# EAGLE design Strain_Gauges_Amplifier_TH (EAGLE 7.6.0)
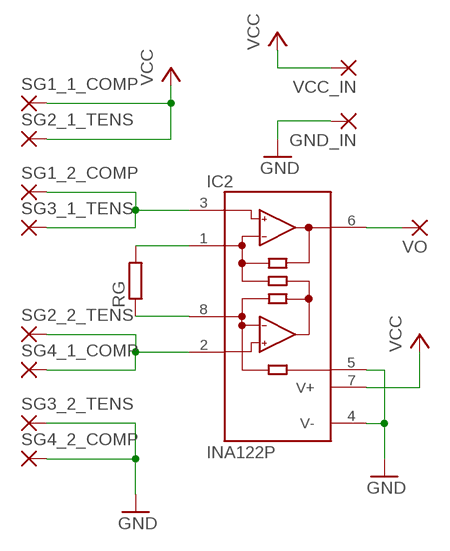
[diagram p0: schematic, sheet 1]

## Parts
GND_IN  SMD2  [SMD1,27-2,54]
IC2  INA122P  [DIL08]
RG  R-EU_0204/7  [0204/7]
SG1_1_COMP  SMD2  [SMD1,27-2,54]
SG1_2_COMP  SMD2  [SMD1,27-2,54]
SG2_1_TENS  SMD2  [SMD1,27-2,54]
SG2_2_TENS  SMD2  [SMD1,27-2,54]
SG3_1_TENS  SMD2  [SMD1,27-2,54]
SG3_2_TENS  SMD2  [SMD1,27-2,54]
SG4_1_COMP  SMD2  [SMD1,27-2,54]
SG4_2_COMP  SMD2  [SMD1,27-2,54]
VCC_IN  SMD2  [SMD1,27-2,54]
VO  SMD2  [SMD1,27-2,54]

## Nets
GND: GND_IN.1(P) IC2.4(V-) IC2.5(REF) SG3_2_TENS.1(P) SG4_2_COMP.1(P)
N$1: IC2.1(RG) RG.2
N$2: IC2.8(RG) RG.1
N$3: IC2.3(+IN) SG1_2_COMP.1(P) SG3_1_TENS.1(P)
N$5: IC2.2(-IN) SG2_2_TENS.1(P) SG4_1_COMP.1(P)
VCC: IC2.7(V+) SG1_1_COMP.1(P) SG2_1_TENS.1(P) VCC_IN.1(P)
VO: IC2.6(OUT) VO.1(P)

## Library data of the parts
GND_IN SG1_1_COMP SG1_2_COMP SG2_1_TENS SG2_2_TENS SG3_1_TENS SG3_2_TENS SG4_1_COMP SG4_2_COMP VCC_IN VO = wirepad:SMD2: SMD PAD
IC2 = burr-brown:INA122: Instrumentation Amplifier Single Supply, MicroPower; MF: TEXAS INSTRUMENTS; MPN: INA122P; OC_FARNELL: 1459460; OC_NEWARK: 15M0948
RG = rcl:R-EU_: RESISTOR, European symbol

## Board
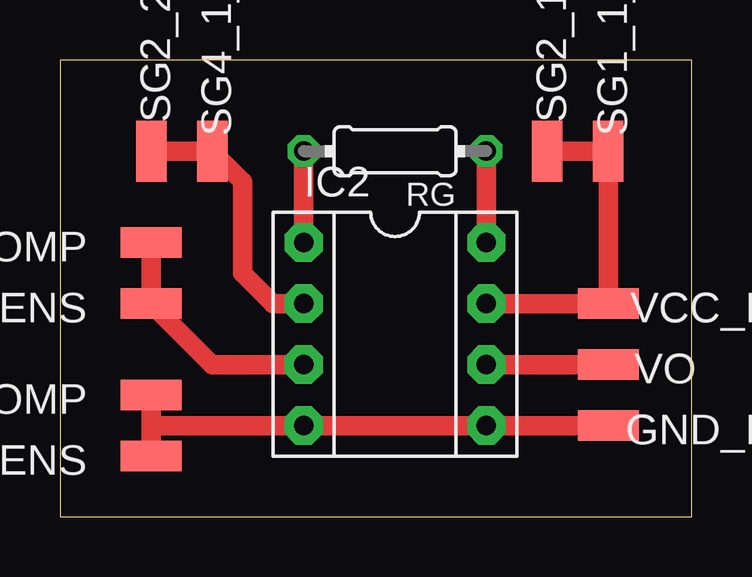
[diagram p1: board, top side]

Size 26.34 x 19.04 mm. Coordinates in mm from the lower left corner, seen from the top.
Outline: 0,0 26.34,0 26.34,19.04 0,19.04 0,0
Copper layers (1*16): Top 0.035mm / dielectric 1.5mm / Bottom 0.035mm
Design rules "default": minimum track width 10mil, minimum drill 24mil, track to track 8mil, track to pad 8mil, pad to pad 8mil, via to via 8mil, smd to smd 8mil, copper to edge 40mil, drill to drill 8mil, minimum pad ring 10mil, minimum via ring 8mil, stop-mask expansion 4mil, vias tented up to drill 0mil, thermal gap 10mil

### Footprints (pad centres in the part's own frame; a part is rotated, then mirrored left to right if it is on the bottom)
SMD1,27-2,54 = smd 1.27 x 2.54: 1 0,0
DIL08 = drill 0.813 pad 1.6 octagon: 1 -3.81,-3.81; 2 -1.27,-3.81; 3 1.27,-3.81; 4 3.81,-3.81; 5 3.81,3.81; 6 1.27,3.81; 7 -1.27,3.81; 8 -3.81,3.81
0204/7 = drill 0.813 octagon: 1 -3.81,0; 2 3.81,0

### Placement (x,y rotation side)
GND_IN  22.86,3.81 90 top
IC2  13.97,7.62 270 top
RG  13.97,15.24 180 top
SG1_1_COMP  22.86,15.24 180 top
SG1_2_COMP  3.81,11.43 90 top
SG2_1_TENS  20.32,15.24 180 top
SG2_2_TENS  3.81,15.24 180 top
SG3_1_TENS  3.81,8.89 90 top
SG3_2_TENS  3.81,2.54 90 top
SG4_1_COMP  6.35,15.24 180 top
SG4_2_COMP  3.81,5.08 90 top
VCC_IN  22.86,8.89 90 top
VO  22.86,6.35 90 top

### Tracks (layer width: path | path; a pad name or v marks a point on that pad's centre or on a via)
GND
  Top 0.813: SG3_2_TENS.1 3.81,3.81 | 3.81,3.81 SG4_2_COMP.1 | 3.81,3.81 IC2.4 IC2.5 GND_IN.1
N$1
  Top 0.813: IC2.1 RG.2
N$2
  Top 0.813: IC2.8 RG.1
N$3
  Top 0.813: SG1_2_COMP.1 SG3_1_TENS.1 6.35,6.35 IC2.3
N$5
  Top 0.813: SG2_2_TENS.1 SG4_1_COMP.1 7.62,13.97 7.62,10.16 8.89,8.89 IC2.2
VCC
  Top 0.813: SG2_1_TENS.1 SG1_1_COMP.1 VCC_IN.1 IC2.7
VO
  Top 0.813: VO.1 IC2.6